# EAGLE design shield (EAGLE 7.2.0)
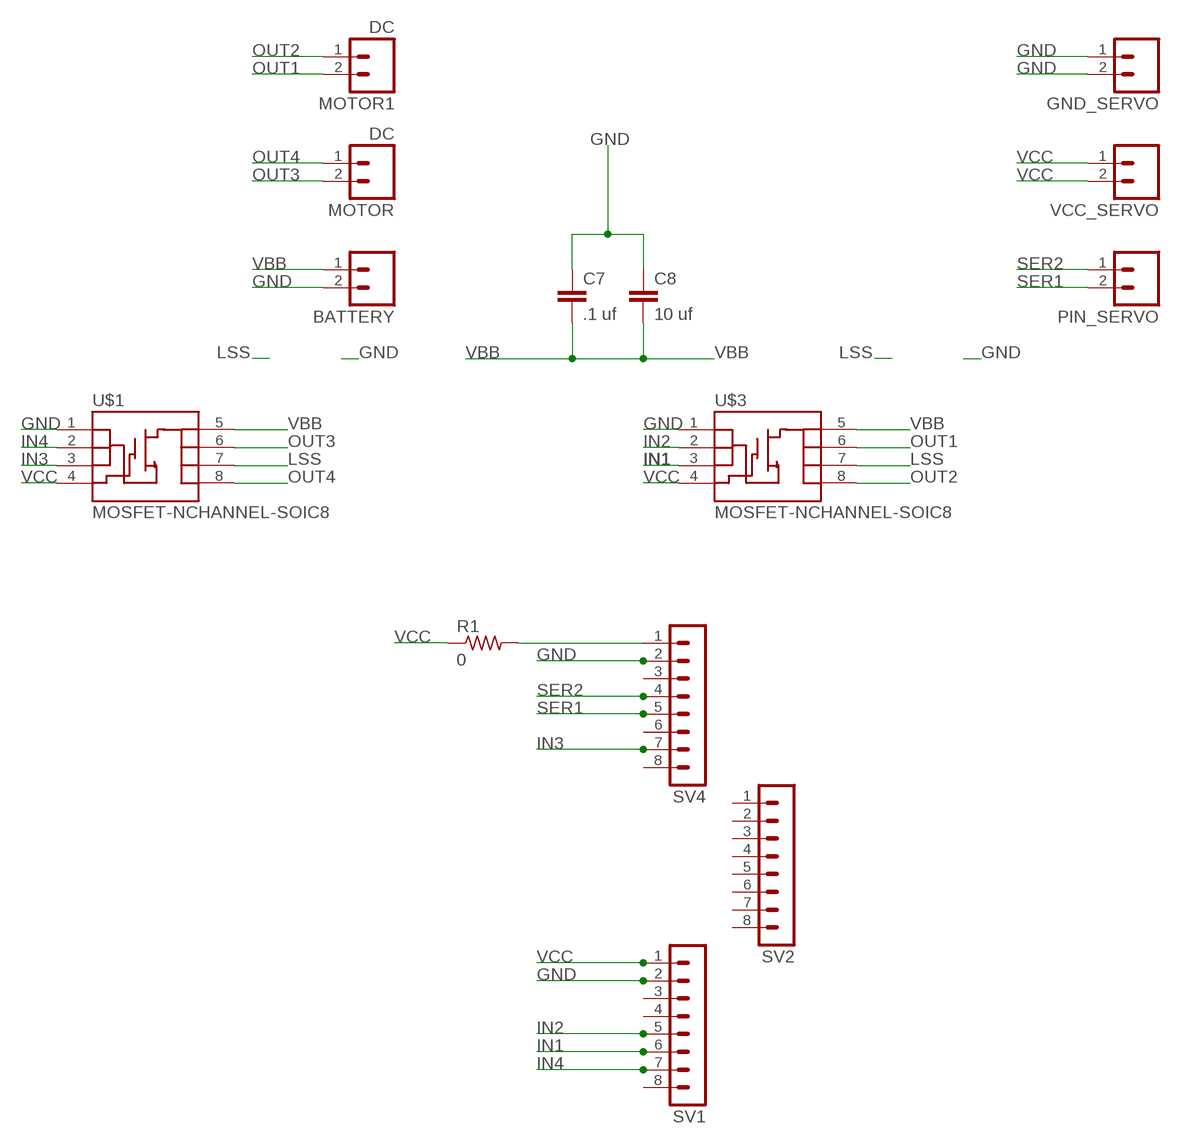
[diagram p0: schematic, sheet 1]

## Parts
BATTERY  M02  [1X02_LONGPADS]
C7  .1 uf  CAP1206  [1206]
C8  10 uf  CAP1206  [1206]
GND_SERVO  M02  [1X02_LONGPADS]
MOTOR  DC  M02  [1X02_LONGPADS]
MOTOR1  DC  M02  [1X02_LONGPADS]
PIN_SERVO  M02  [1X02_LONGPADS]
R1  0  RESISTOR1206  [1206]
SV1  MA08-1  [MA08-1]
SV2  MA08-1  [MA08-1]
SV4  MA08-1  [MA08-1]
U$1  MOSFET-NCHANNEL-SOIC8  [SO08]
U$3  MOSFET-NCHANNEL-SOIC8  [SO08]
VCC_SERVO  M02  [1X02_LONGPADS]

## Nets
GND: BATTERY.2 C7.1 C8.1 GND_SERVO.1 GND_SERVO.2 SV1.2 SV4.2 U$1.1(S) U$3.1(S)
IN1: SV1.6 U$3.3(S)
IN2: SV1.5 U$3.2(S)
IN3: SV4.7 U$1.3(S)
IN4: SV1.7 U$1.2(S)
LSS: U$1.7(D) U$3.7(D)
N$1: R1.2 SV4.1
OUT1: MOTOR1.2 U$3.6(D)
OUT2: MOTOR1.1 U$3.8(D)
OUT3: MOTOR.2 U$1.6(D)
OUT4: MOTOR.1 U$1.8(D)
SER1: PIN_SERVO.2 SV4.5
SER2: PIN_SERVO.1 SV4.4
VBB: BATTERY.1 C7.2 C8.2 U$1.5(D) U$3.5(D)
VCC: R1.1 SV1.1 U$1.4(G) U$3.4(G) VCC_SERVO.1 VCC_SERVO.2
Unconnected: SV1.3 SV1.4 SV1.8 SV2.1 SV2.2 SV2.3 SV2.4 SV2.5 SV2.6 SV2.7 SV2.8 SV4.3 SV4.6 SV4.8

## Library data of the parts
BATTERY GND_SERVO MOTOR MOTOR1 PIN_SERVO VCC_SERVO = 01_SparkFun:M02: Header 2 Standard 2-pin 0.1" header. Use with straight break away headers (SKU : PRT-00116), right angle break away headers (PRT-00553), swiss pins (PRT-00743), machine pins (PRT-00117), and female headers (PRT-00115). Molex polarized connector foot print use with SKU : PRT-08233 with associated crimp pins and housings.
C7 C8 = 01_SparkFun:CAP: Capacitor Standard 0603 ceramic capacitor, and 0.1" leaded capacitor.
R1 = 01_FAB_Hello:RESISTOR
SV1 SV2 SV4 = con-lstb:MA08-1: PIN HEADER
U$1 U$3 = 01_SparkFun:MOSFET-NCHANNEL-SOIC8: N-Channel MOSFET IRF9410 and NDS8434 are common, SOIC-8 parts.

## Board
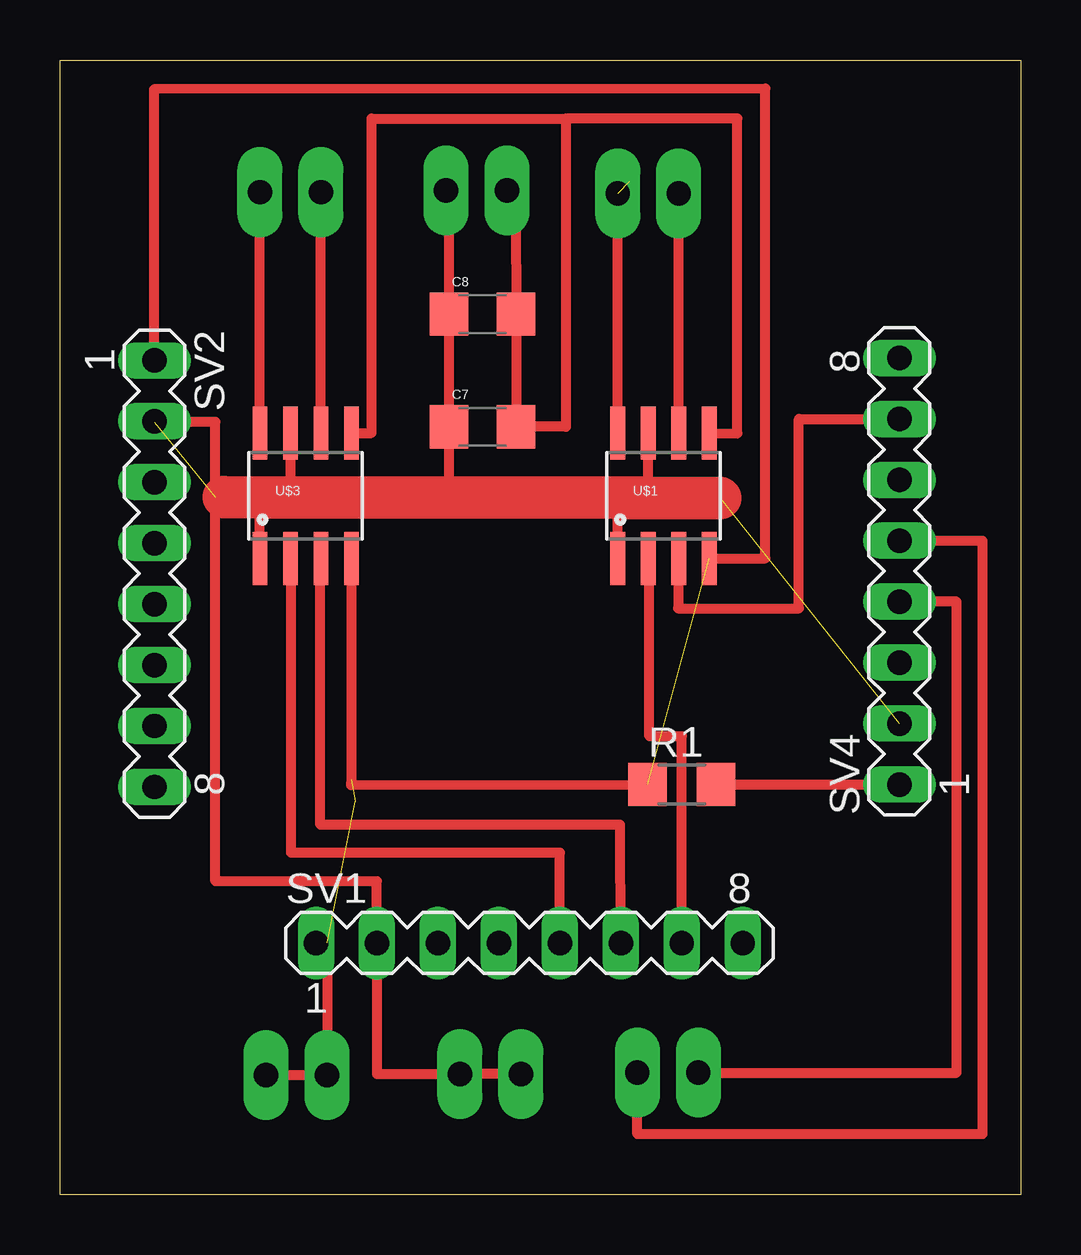
[diagram p1: board, top side]

Size 40.03 x 47.29 mm. Coordinates in mm from the lower left corner, seen from the top.
Outline: 0,47.3 40.03,47.3 40.03,0 0,0 0,47.3
Copper layers (1*16): Top 0.035mm / dielectric 1.5mm / Bottom 0.035mm
Design rules "default *": minimum track width 10mil, minimum drill 24mil, track to track 16mil, track to pad 16mil, pad to pad 16mil, via to via 16mil, smd to smd 16mil, copper to edge 16mil, drill to drill 8mil, minimum pad ring 10mil, minimum via ring 8mil, stop-mask expansion 4mil, vias tented up to drill 0mil, thermal gap 10mil

### Footprints (pad centres in the part's own frame; a part is rotated, then mirrored left to right if it is on the bottom)
1X02_LONGPADS = drill 1.016 pad 1.88 long: 1 0,0; 2 2.54,0
1206 = smd 1.6 x 1.8: 1 -1.4,0; 2 1.4,0
1206' = smd 1.6 x 1.803: 1 -1.422,0; 2 1.422,0
MA08-1 = drill 1.016 long: 1 -8.89,0; 2 -6.35,0; 3 -3.81,0; 4 -1.27,0; 5 1.27,0; 6 3.81,0; 7 6.35,0; 8 8.89,0
SO08 = smd 0.61 x 2.21: 1 -1.905,-2.616; 2 -0.635,-2.616; 3 0.635,-2.616; 4 1.905,-2.616; 5 1.905,2.616; 6 0.635,2.616; 7 -0.635,2.616; 8 -1.905,2.616

### Placement (x,y rotation side)
BATTERY  18.62,41.86 180 top
C7  17.6,32 0 top
C8  17.6,36.7 0 top
GND_SERVO  16.66,5.03 0 top
MOTOR  23.24,41.73 0 top
MOTOR1  8.33,41.78 0 top
PIN_SERVO  26.59,5.08 180 top
R1  0  [1206']  25.91,17.09 0 top
SV1  19.56,10.49 0 top
SV2  3.94,25.88 270 top
SV4  34.98,25.98 90 top
U$1  25.15,29.13 0 top
U$3  10.24,29.13 0 top
VCC_SERVO  8.59,4.98 0 top

### Tracks (layer width: path | path; a pad name or v marks a point on that pad's centre or on a via)
GND  (2 unrouted)
  Top 0.305: BATTERY.2 16.2,41.86 | 16.2,29.06 16.2,29.03 23.24,29.03
  Top 0.406: U$3.1 8.33,29.06 | 16.2,41.86 C8.1 C7.1 16.2,29.06 | U$1.1 23.24,29.03 | GND_SERVO.2 GND_SERVO.1 13.21,5.03 SV1.2 13.21,13.06 6.48,13.06 6.48,32.21 3.94,32.21 | 6.48,29.08 6.83,29.08
  Top 1.778: 6.83,29.08 8.33,29.06 16.2,29.06 | 23.24,29.03 27.51,29.03
IN1
  Top 0.305: 10.85,26.52 U$3.3
  Top 0.406: SV1.6 23.34,15.42 10.85,15.42 10.85,26.52
IN2
  Top 0.305: 9.63,26.52 U$3.2
  Top 0.406: SV1.5 20.83,14.25 9.63,14.25 9.63,26.52
IN3
  Top 0.406: U$1.3 25.76,24.43 30.79,24.43 30.79,32.33 SV4.7
IN4
  Top 0.406: SV1.7 25.91,19.1 24.56,19.1 24.56,26.52 U$1.2
LSS
  Top 0.406: U$3.7 9.6,29.06 | 24.51,29.06 U$1.7
  Top 1.778: 9.6,29.06 24.51,29.06
N$1
  Top 0.406: R1.2 SV4.1
OUT1
  Top 0.406: U$3.6 MOTOR1.2
OUT2
  Top 0.406: U$3.8 MOTOR1.1
OUT3
  Top 0.406: U$1.6 MOTOR.2
OUT4  (1 unrouted)
  Top 0.305: 23.24,42.22 23.72,42.22
  Top 0.406: U$1.8 23.24,42.22
SER1
  Top 0.406: SV4.5 38.43,27.25 38.43,2.52 24.05,2.52 PIN_SERVO.2
SER2
  Top 0.406: PIN_SERVO.1 37.36,5.08 37.36,24.71 SV4.4
VBB
  Top 0.406: BATTERY.1 19,40.84 C8.2 C7.2 21.08,32 21.08,44.86 | U$3.5 12.98,31.75 12.98,44.86 21.08,44.86 | U$1.5 28.22,31.73 28.22,44.86 21.08,44.86
VCC  (3 unrouted)
  Top 0.406: U$3.4 12.14,17.3 12.12,17.07 R1.1 | SV1.1 11.12,10.49 VCC_SERVO.2 VCC_SERVO.1 | U$1.4 29.39,26.52 29.39,46.1 3.91,46.08 3.91,34.57 4.01,34.54 4.01,34.77